# EAGLE schematic RomeBoardV1 (EAGLE 8.6.0)

## Sheet 1 of 3: Power and Regulation
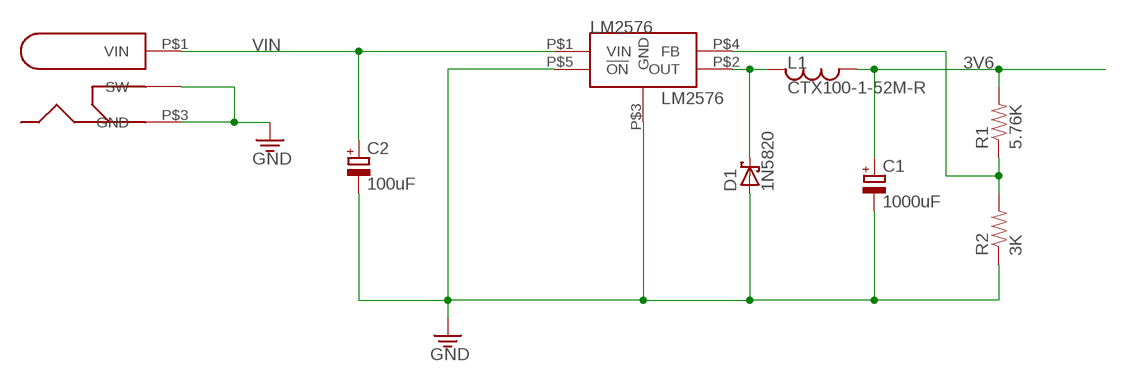
[diagram p0: schematic, sheet 1]

### Parts
C1  1000uF  CPOL-EUE7.5-16  [E7,5-16]
C2  100uF  CPOL-EUE3.5-10  [E3,5-10]
D1  1N5820  [DO-201AD]
L1  CTX100-1-52M-R  [CTX100-1-52M-R]
LM2576  LM2576  [TO-220-5]
R1  5.76K  RESISTOR-PTH0.4  [AXIAL-0.4]
R2  3K  RESISTOR-PTH0.4  [AXIAL-0.4]
U$2  PJ-002A  [PJ-002A]

### Nets
3V6: C1.+ L1.P$3 R1.2 ; also sheet 2,3
GND: C1.- C2.- D1.P$1(A) LM2576.P$3(GND) LM2576.P$5(!ON) R2.1 U$2.P$2(SW) U$2.P$3(GND) ; also sheet 2,3
N$1: D1.P$2(C) L1.P$1 LM2576.P$2(OUT)
N$8: LM2576.P$4(FB) R1.1 R2.2
VIN: C2.+ LM2576.P$1(VIN) U$2.P$1(VIN) ; also sheet 2,3

## Sheet 2 of 3: Connectors
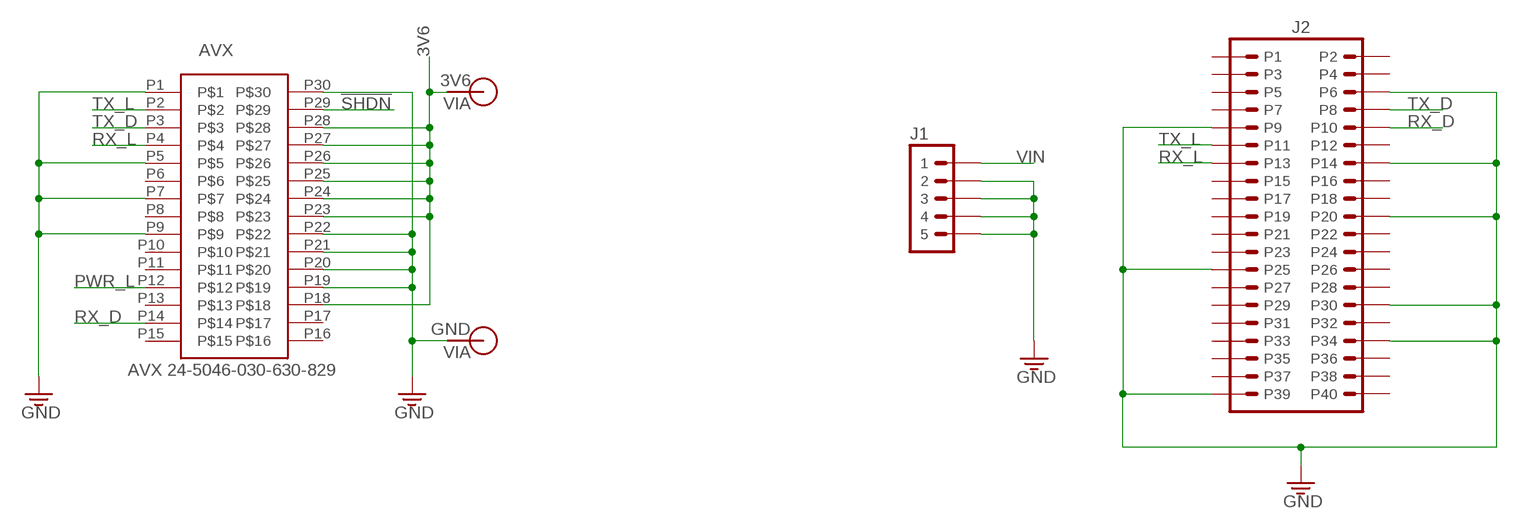
[diagram p1: schematic, sheet 2]

### Parts
AVX  AVX-24-5046-030-630-829  [AVX-24-5046-630-829]
J1  HEADER-5  [HEADER-05]
J2  RASPBERRY-PI-HEADER  [HEADER-20X02]
V4  GND  VIA-120MIL  [VIA-120MIL]
V5  3V6  VIA-120MIL  [VIA-120MIL]

### Nets
3V6: AVX.P18 AVX.P23 AVX.P24 AVX.P25 AVX.P26 AVX.P27 AVX.P28 V5.P$1 ; also sheet 1,3
!SHDN: AVX.P29
GND: AVX.P1 AVX.P5 AVX.P7 AVX.P9 AVX.P19 AVX.P20 AVX.P21 AVX.P22 AVX.P30 J1.2 J1.3 J1.4 J1.5 J2.P6 J2.P9 J2.P14 J2.P20 J2.P25 J2.P30 J2.P34 J2.P39 V4.P$1 ; also sheet 1,3
PWR_L: AVX.P12 ; also sheet 3
RX_D: AVX.P14 J2.P10
RX_L: AVX.P4 J2.P13 ; also sheet 3
TX_D: AVX.P3 J2.P8
TX_L: AVX.P2 J2.P11 ; also sheet 3
VIN: J1.1 ; also sheet 1,3
Unconnected: AVX.P6 AVX.P8 AVX.P10 AVX.P11 AVX.P13 AVX.P15 AVX.P16 AVX.P17 J2.P1 J2.P2 J2.P3 J2.P4 J2.P5 J2.P7 J2.P12 J2.P15 J2.P16 J2.P17 J2.P18 J2.P19 J2.P21 J2.P22 J2.P23 J2.P24 J2.P26 J2.P27 J2.P28 J2.P29 J2.P31 J2.P32 J2.P33 J2.P35 J2.P36 J2.P37 J2.P38 J2.P40

## Sheet 3 of 3: LEDs
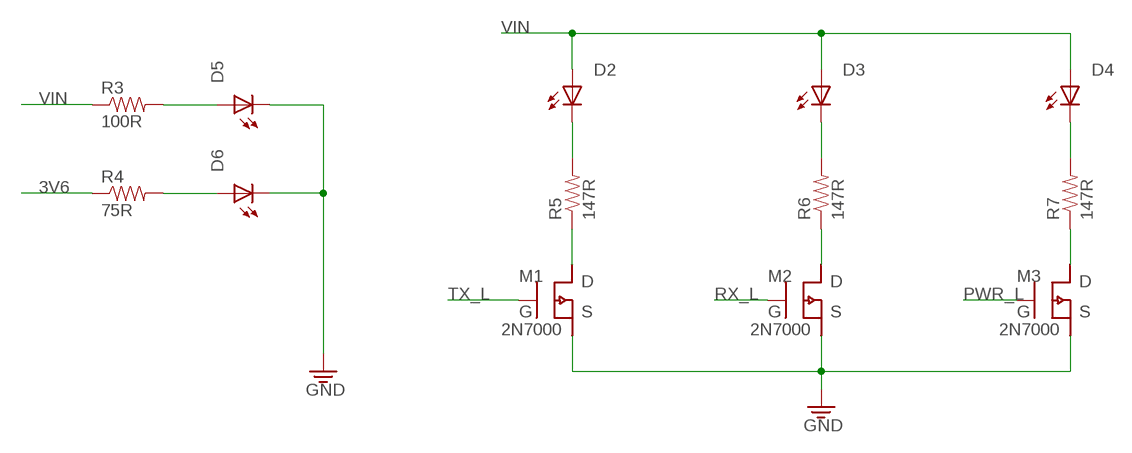
[diagram p2: schematic, sheet 3]

### Parts
D2  LEDTHRU-HOLE-CONNECTOR  [1X2-POL]
D3  LEDTHRU-HOLE-CONNECTOR  [1X2-POL]
D4  LEDTHRU-HOLE-CONNECTOR  [1X2-POL]
D5  LEDTHRU-HOLE-CONNECTOR  [1X2-POL]
D6  LEDTHRU-HOLE-CONNECTOR  [1X2-POL]
M1  2N7000  [TO-923-MOS]
M2  2N7000  [TO-923-MOS]
M3  2N7000  [TO-923-MOS]
R3  100R  RESISTOR-PTH0.4  [AXIAL-0.4]
R4  75R  RESISTOR-PTH0.4  [AXIAL-0.4]
R5  147R  RESISTOR-PTH0.4  [AXIAL-0.4]
R6  147R  RESISTOR-PTH0.4  [AXIAL-0.4]
R7  147R  RESISTOR-PTH0.4  [AXIAL-0.4]

### Nets
3V6: R4.1 ; also sheet 1,2
GND: D5.2(C) D6.2(C) M1.3(S) M2.3(S) M3.3(S) ; also sheet 1,2
N$2: D5.1(A) R3.2
N$3: D6.1(A) R4.2
N$4: D3.2(C) R6.2
N$5: M1.1(D) R5.1
N$6: M2.1(D) R6.1
N$7: M3.1(D) R7.1
N$9: D4.2(C) R7.2
N$10: D2.2(C) R5.2
PWR_L: M3.2(G) ; also sheet 2
RX_L: M2.2(G) ; also sheet 2
TX_L: M1.2(G) ; also sheet 2
VIN: D2.1(A) D3.1(A) D4.1(A) R3.1 ; also sheet 1,2

## Library data of the parts
AVX = CNTRL_BOARD:AVX-24-5046-030-630-829
C1 C2 = resistor:CPOL-EU: POLARIZED CAPACITOR, European symbol
D1 = BrownSpaceEngineering:1N5820
D2-D6 = BrownSpaceEngineering:LED
J1 = BrownSpaceEngineering:HEADER-5
J2 = BrownSpaceEngineering:RASPBERRY-PI-HEADER
L1 = BrownSpaceEngineering:CTX100-1-52M-R
LM2576 = BrownSpaceEngineering:LM2576
M1-M3 = BrownSpaceEngineering:2N7000
R1-R7 = passives:RESISTOR: Resistor 0805 <http://www.digikey.com/product-search/en/resistors/chip-resistor-surface-mount/65769?FV=fffc000a%2C80005%2Cc0002%2C1c0002%2C400006%2C52403b5%2Cfff40001%2Cfff800e9&mnonly=0&newproducts=0&ColumnSort=1000011&page=1&stock=1&pbfree=1&rohs=1&k=&quantity=1&ptm=0&fid=0&pageSize=500>
U$2 = BrownSpaceEngineering:PJ-002A
V4 V5 = BrownSpaceEngineering:VIA